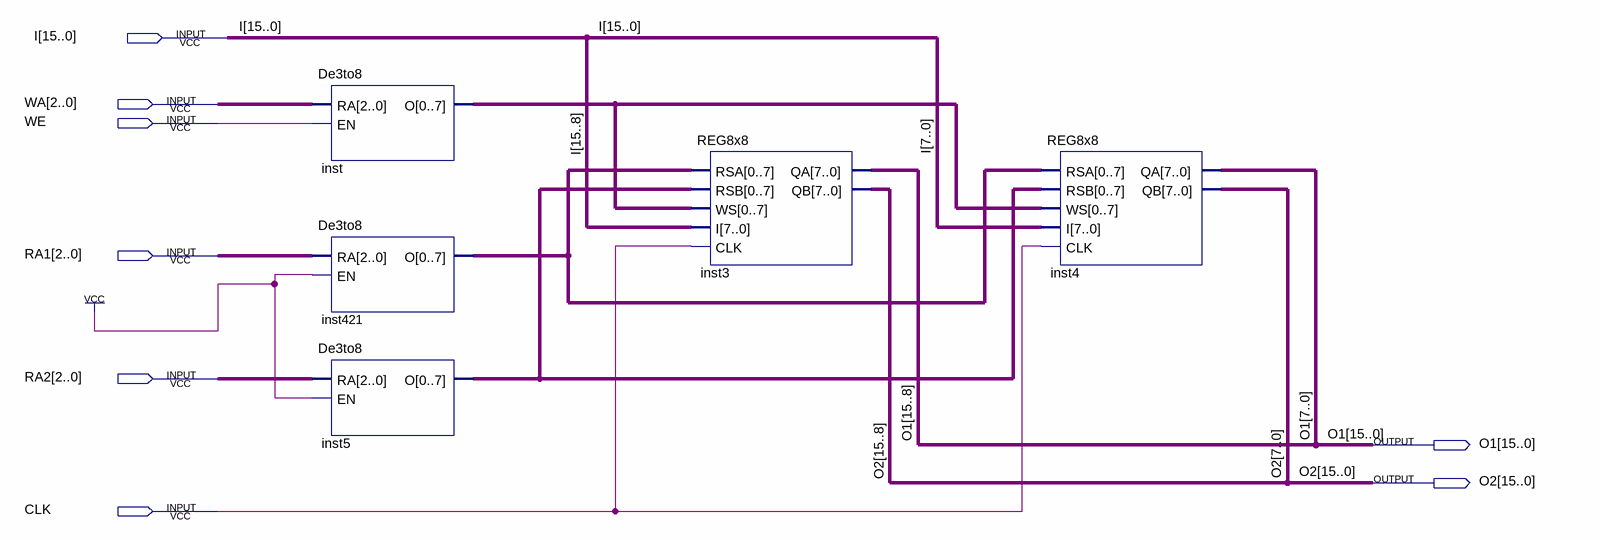
[diagram p0: schematic sheet]
// Quartus schematic REG8x16.bdf as structural Verilog: 5 symbols, 8 pins
module REG8x16 (
  input  [15:0] I,
  input  [2:0] WA,
  input  WE,
  input  [2:0] RA1,
  input  [2:0] RA2,
  input  CLK,
  output [15:0] O1,
  output [15:0] O2
);

  wire [7:0] inst5_o, inst421_o, inst_o;

  De3to8 inst (.RA(WA), .EN(WE), .O(inst_o));
  De3to8 inst421 (.RA(RA1), .EN(1'b1), .O(inst421_o));
  De3to8 inst5 (.RA(RA2), .EN(1'b1), .O(inst5_o));
  REG8x8 inst3 (.RSA(inst421_o), .RSB(inst5_o), .WS(inst_o), .I(I[15:8]), .CLK(CLK), .QA(O1[15:8]), .QB(O2[15:8]));
  REG8x8 inst4 (.RSA(inst421_o), .RSB(inst5_o), .WS(inst_o), .I(I[7:0]), .CLK(CLK), .QA(O1[7:0]), .QB(O2[7:0]));
endmodule
